# EAGLE design RpiStack (EAGLE 9.3.0)
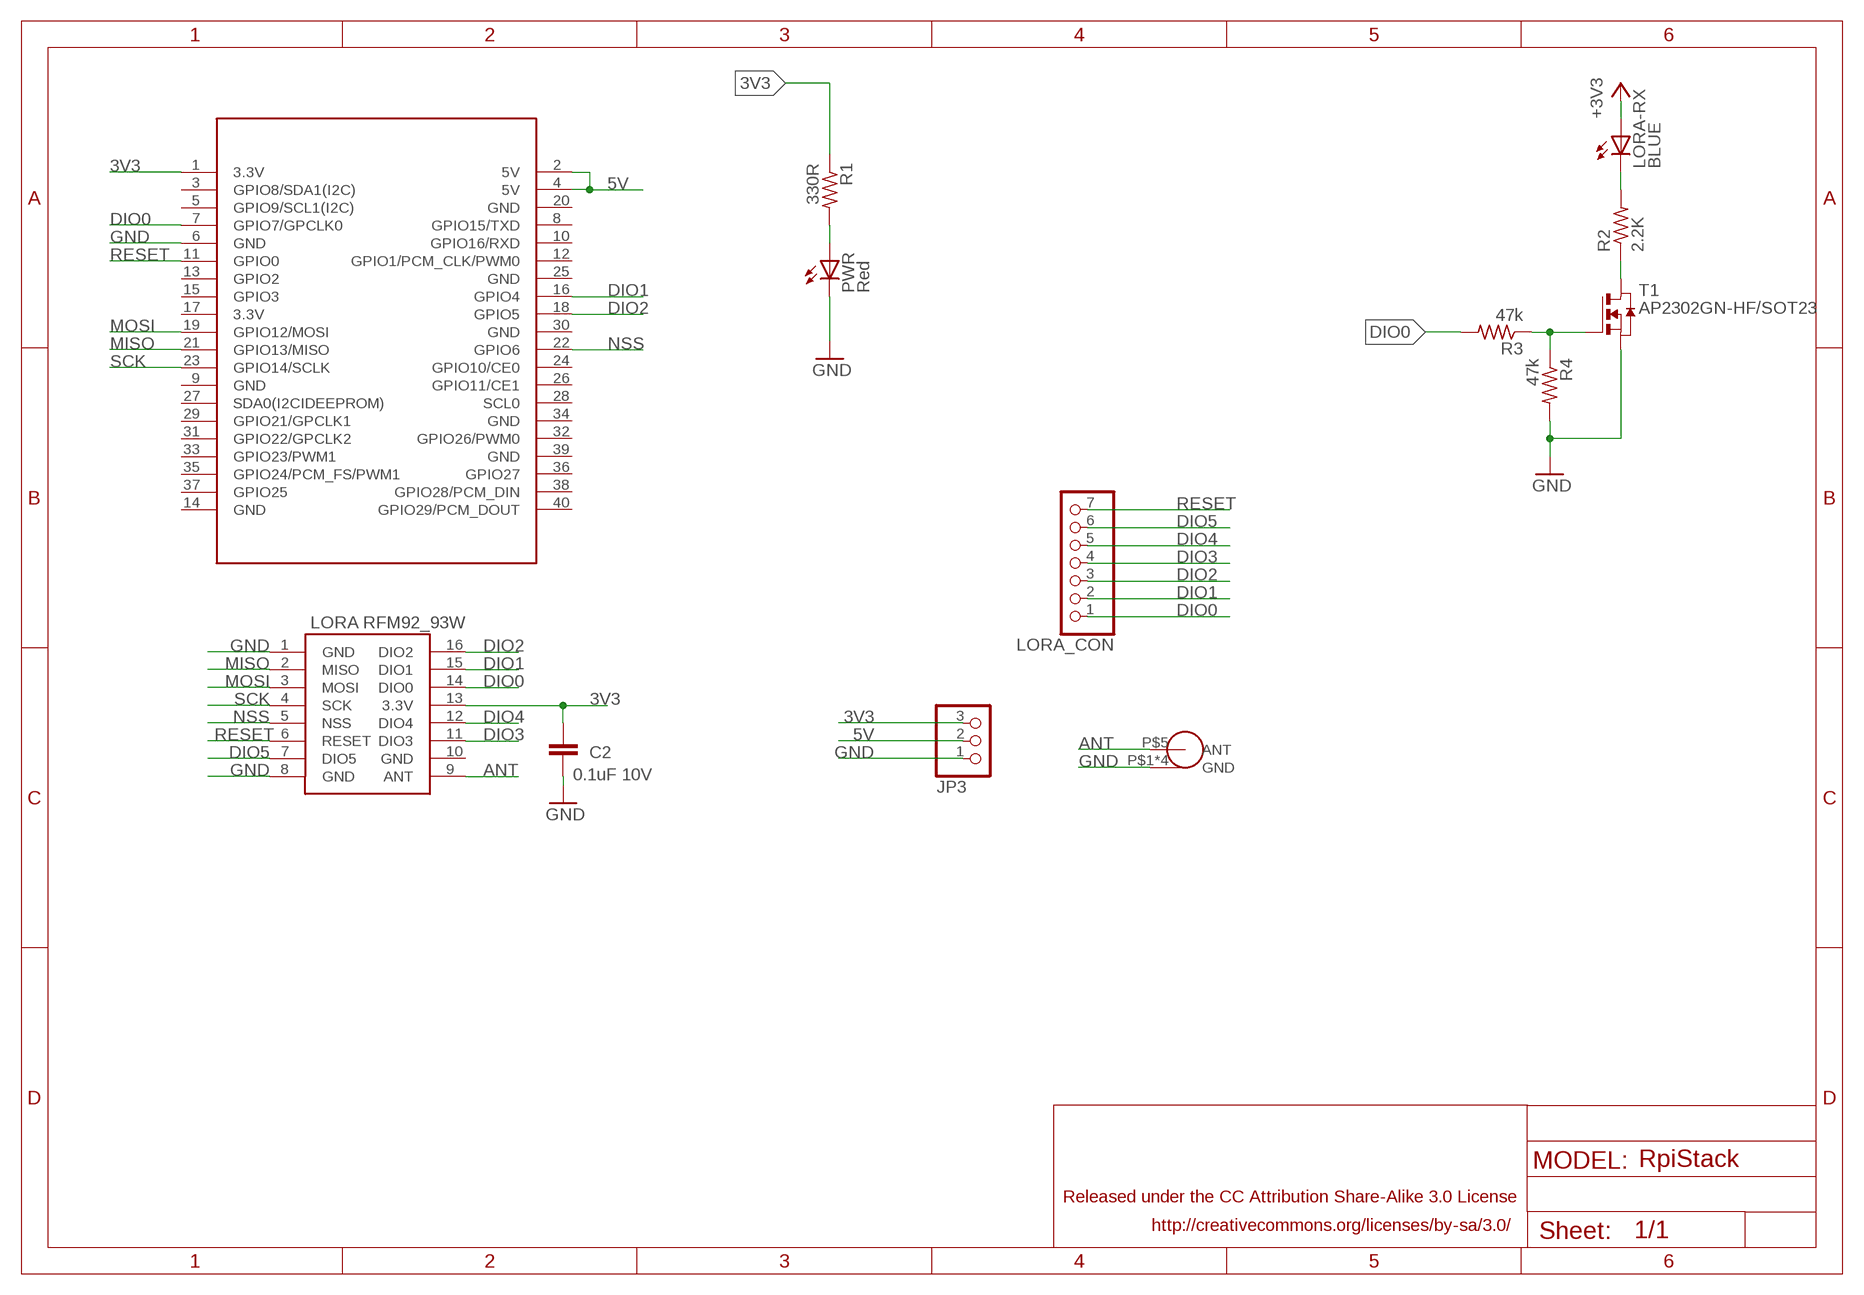
[diagram p0: schematic, sheet 1]

## Parts
C2  0.1uF 10V  C-EUC0402  [C0402]
JP3  PINHD-1X3  [1X03]
LORA  RFM92_93W  [RFM92_93W]
LORA-RX  BLUE  LEDCHIPLED_0603  [CHIPLED_0603]
LORA_ANT  SMA-KE  [SMA-KE]
LORA_CON  PINHD-1X7  [1X07]
PWR  Red  LEDCHIPLED_0603  [CHIPLED_0603]
R1  330R  R-US_R0402  [R0402]
R2  2.2K  R-US_R0402  [R0402]
R3  47k  R-US_R0402  [R0402]
R4  47k  R-US_R0402  [R0402]
T1  AP2302GN-HF/SOT23  NMOSFET-SOT23  [SOT-23]
U$2  RPILORASHIELD  [RPILORASHIELD]

## Nets
3V3: C2.2 JP3.3 LORA-RX.A LORA.13(3.3V) R1.1 U$2.1(3.3V) ; supply symbol labelled +3V3
5V: JP3.2 U$2.2(5V) U$2.4(5V)
/RESET: R2.1 T1.1(D)
ANT: LORA.9(ANT) LORA_ANT.P$5(ANT)
DIO0: LORA.14(DIO0) LORA_CON.1 R3.2 U$2.7(GPIO7/GPCLK0)
DIO1: LORA.15(DIO1) LORA_CON.2 U$2.16(GPIO4)
DIO2: LORA.16(DIO2) LORA_CON.3 U$2.18(GPIO5)
DIO3: LORA.11(DIO3) LORA_CON.4
DIO4: LORA.12(DIO4) LORA_CON.5
DIO5: LORA.7(DIO5) LORA_CON.6
GND: C2.1 JP3.1 LORA.1(GND) LORA.8(GND) LORA_ANT.P$1(GND) LORA_ANT.P$2(GND) LORA_ANT.P$3(GND) LORA_ANT.P$4(GND) PWR.C R4.2 T1.2(S) U$2.6(GND)
MISO: LORA.2(MISO) U$2.21(GPIO13/MISO)
MOSI: LORA.3(MOSI) U$2.19(GPIO12/MOSI)
N$1: R3.1 R4.1 T1.3(G)
N$6: PWR.A R1.2
N$60: LORA-RX.C R2.2
NSS: LORA.5(NSS) U$2.22(GPIO6)
RESET: LORA.6(RESET) LORA_CON.7 U$2.11(GPIO0)
SCK: LORA.4(SCK) U$2.23(GPIO14/SCLK)
Unconnected: U$2.3(GPIO8/SDA1(I2C)) U$2.5(GPIO9/SCL1(I2C)) U$2.8(GPIO15/TXD) U$2.9(GND) U$2.10(GPIO16/RXD) U$2.12(GPIO1/PCM_CLK/PWM0) U$2.13(GPIO2) U$2.14(GND) U$2.15(GPIO3) U$2.17(3.3V) U$2.20(GND) U$2.24(GPIO10/CE0) U$2.25(GND) U$2.26(GPIO11/CE1) U$2.27(SDA0(I2CIDEEPROM)) U$2.28(SCL0) U$2.29(GPIO21/GPCLK1) U$2.30(GND) U$2.31(GPIO22/GPCLK2) U$2.32(GPIO26/PWM0) U$2.33(GPIO23/PWM1) U$2.34(GND) U$2.35(GPIO24/PCM_FS/PWM1) U$2.36(GPIO27) U$2.37(GPIO25) U$2.38(GPIO28/PCM_DIN) U$2.39(GND) U$2.40(GPIO29/PCM_DOUT)

## Power pins joined to a net without a drawn wire
GND: LORA.10(GND)

## Library data of the parts
C2 = dragino-passive:C-EU: CAPACITOR, European symbol
JP3 = pinhead:PINHD-1X3: PIN HEADER
LORA = dragino:RFM92_93W
LORA-RX = dragino-passive:LED: LED OSRAM: - CHIPLED LG R971, LG N971, LY N971, LG Q971, LY Q971, LO R971, LY R971 LH N974, LH R974 LS Q976, LO Q976, LY Q976 LO Q996 - Hyper CHIPLED LW Q18S LB Q993, LB Q99A, LB R99A - SideLED LS A670, LO A670, LY A670, LG A670, LP A670 LB A673, LV A673, LT A673, LW A673 LH A674 LY A675 LS A676, LA A676, LO A676, LY A676, LW A676 LS A679, LY A679, LG A679 - Hyper Micro SIDELED® LS Y876, LA Y876, LO Y876, LY Y876 LT Y87S - SmartLED LW L88C, LW L88S LB L89C, LB L89S, LG L890 LS L89K, LO L89K, LY L89K LS L896, LA L896, LO L896, LY L896 - TOPLED LS T670, LO T670, LY T670, LG T670, LP T670 LSG T670, LSP T670, LSY T670, LOP T670, LYG T670 LG T671, LOG T671, LSG T671 LB T673, LV T673, LT T673, LW T673 LH T674 LS T676, LA T676, LO T676, LY T676, LB T676, LH T676, LSB T676, LW T676 LB T67C, LV T67C, LT T67C, LS T67K, LO T67K, LY T67K, LW E67C LS E67B, LA E67B, LO E67B, LY E67B, LB E67C, LV E67C, LT E67C LW T67C LS T679, LY T679, LG T679 LS T770, LO T770, LY T770, LG T770, LP T770 LB T773, LV T773, LT T773, LW T773 LH T774 LS E675, LA E675, LY E675, LS T675 LS T776, LA T776, LO T776, LY T776, LB T776 LHGB T686 LT T68C, LB T68C - Hyper Mini TOPLED® LB M676 - Mini TOPLED Santana® LG M470 LS M47K, LO M47K, LY M47K Source: http://www.osram.convergy.de LUXEON: - LUMILED® LXK2-PW12-R00, LXK2-PW12-S00, LXK2-PW14-U00, LXK2-PW14-V00 LXK2-PM12-R00, LXK2-PM12-S00, LXK2-PM14-U00 LXK2-PE12-Q00, LXK2-PE12-R00, LXK2-PE12-S00, LXK2-PE14-T00, LXK2-PE14-U00 LXK2-PB12-K00, LXK2-PB12-L00, LXK2-PB12-M00, LXK2-PB14-N00, LXK2-PB14-P00, LXK2-PB14-Q00 LXK2-PR12-L00, LXK2-PR12-M00, LXK2-PR14-Q00, LXK2-PR14-R00 LXK2-PD12-Q00, LXK2-PD12-R00, LXK2-PD12-S00 LXK2-PH12-R00, LXK2-PH12-S00 LXK2-PL12-P00, LXK2-PL12-Q00, LXK2-PL12-R00 Source: www.luxeon.com KINGBRIGHT: KA-3528ASYC Source: www.kingbright.com
LORA_ANT = sma-ke:SMA-KE
LORA_CON = pinhead:PINHD-1X7: PIN HEADER
PWR = dragino:LED: LED OSRAM: - CHIPLED LG R971, LG N971, LY N971, LG Q971, LY Q971, LO R971, LY R971 LH N974, LH R974 LS Q976, LO Q976, LY Q976 LO Q996 - Hyper CHIPLED LW Q18S LB Q993, LB Q99A, LB R99A - SideLED LS A670, LO A670, LY A670, LG A670, LP A670 LB A673, LV A673, LT A673, LW A673 LH A674 LY A675 LS A676, LA A676, LO A676, LY A676, LW A676 LS A679, LY A679, LG A679 - Hyper Micro SIDELED® LS Y876, LA Y876, LO Y876, LY Y876 LT Y87S - SmartLED LW L88C, LW L88S LB L89C, LB L89S, LG L890 LS L89K, LO L89K, LY L89K LS L896, LA L896, LO L896, LY L896 - TOPLED LS T670, LO T670, LY T670, LG T670, LP T670 LSG T670, LSP T670, LSY T670, LOP T670, LYG T670 LG T671, LOG T671, LSG T671 LB T673, LV T673, LT T673, LW T673 LH T674 LS T676, LA T676, LO T676, LY T676, LB T676, LH T676, LSB T676, LW T676 LB T67C, LV T67C, LT T67C, LS T67K, LO T67K, LY T67K, LW E67C LS E67B, LA E67B, LO E67B, LY E67B, LB E67C, LV E67C, LT E67C LW T67C LS T679, LY T679, LG T679 LS T770, LO T770, LY T770, LG T770, LP T770 LB T773, LV T773, LT T773, LW T773 LH T774 LS E675, LA E675, LY E675, LS T675 LS T776, LA T776, LO T776, LY T776, LB T776 LHGB T686 LT T68C, LB T68C - Hyper Mini TOPLED® LB M676 - Mini TOPLED Santana® LG M470 LS M47K, LO M47K, LY M47K Source: http://www.osram.convergy.de LUXEON: - LUMILED® LXK2-PW12-R00, LXK2-PW12-S00, LXK2-PW14-U00, LXK2-PW14-V00 LXK2-PM12-R00, LXK2-PM12-S00, LXK2-PM14-U00 LXK2-PE12-Q00, LXK2-PE12-R00, LXK2-PE12-S00, LXK2-PE14-T00, LXK2-PE14-U00 LXK2-PB12-K00, LXK2-PB12-L00, LXK2-PB12-M00, LXK2-PB14-N00, LXK2-PB14-P00, LXK2-PB14-Q00 LXK2-PR12-L00, LXK2-PR12-M00, LXK2-PR14-Q00, LXK2-PR14-R00 LXK2-PD12-Q00, LXK2-PD12-R00, LXK2-PD12-S00 LXK2-PH12-R00, LXK2-PH12-S00 LXK2-PL12-P00, LXK2-PL12-Q00, LXK2-PL12-R00 Source: www.luxeon.com KINGBRIGHT: KA-3528ASYC Source: www.kingbright.com
R1-R4 = dragino:R-US_: RESISTOR, American symbol
T1 = dragino:NMOSFET-SOT23: MOS FET; OC_FARNELL: unknown; OC_NEWARK: unknown
U$2 = lorarpi:RPILORASHIELD

## Net classes
2 gnd: width 0.254 mm, drill 0.61 mm, clearance 0.254 mm

## Board
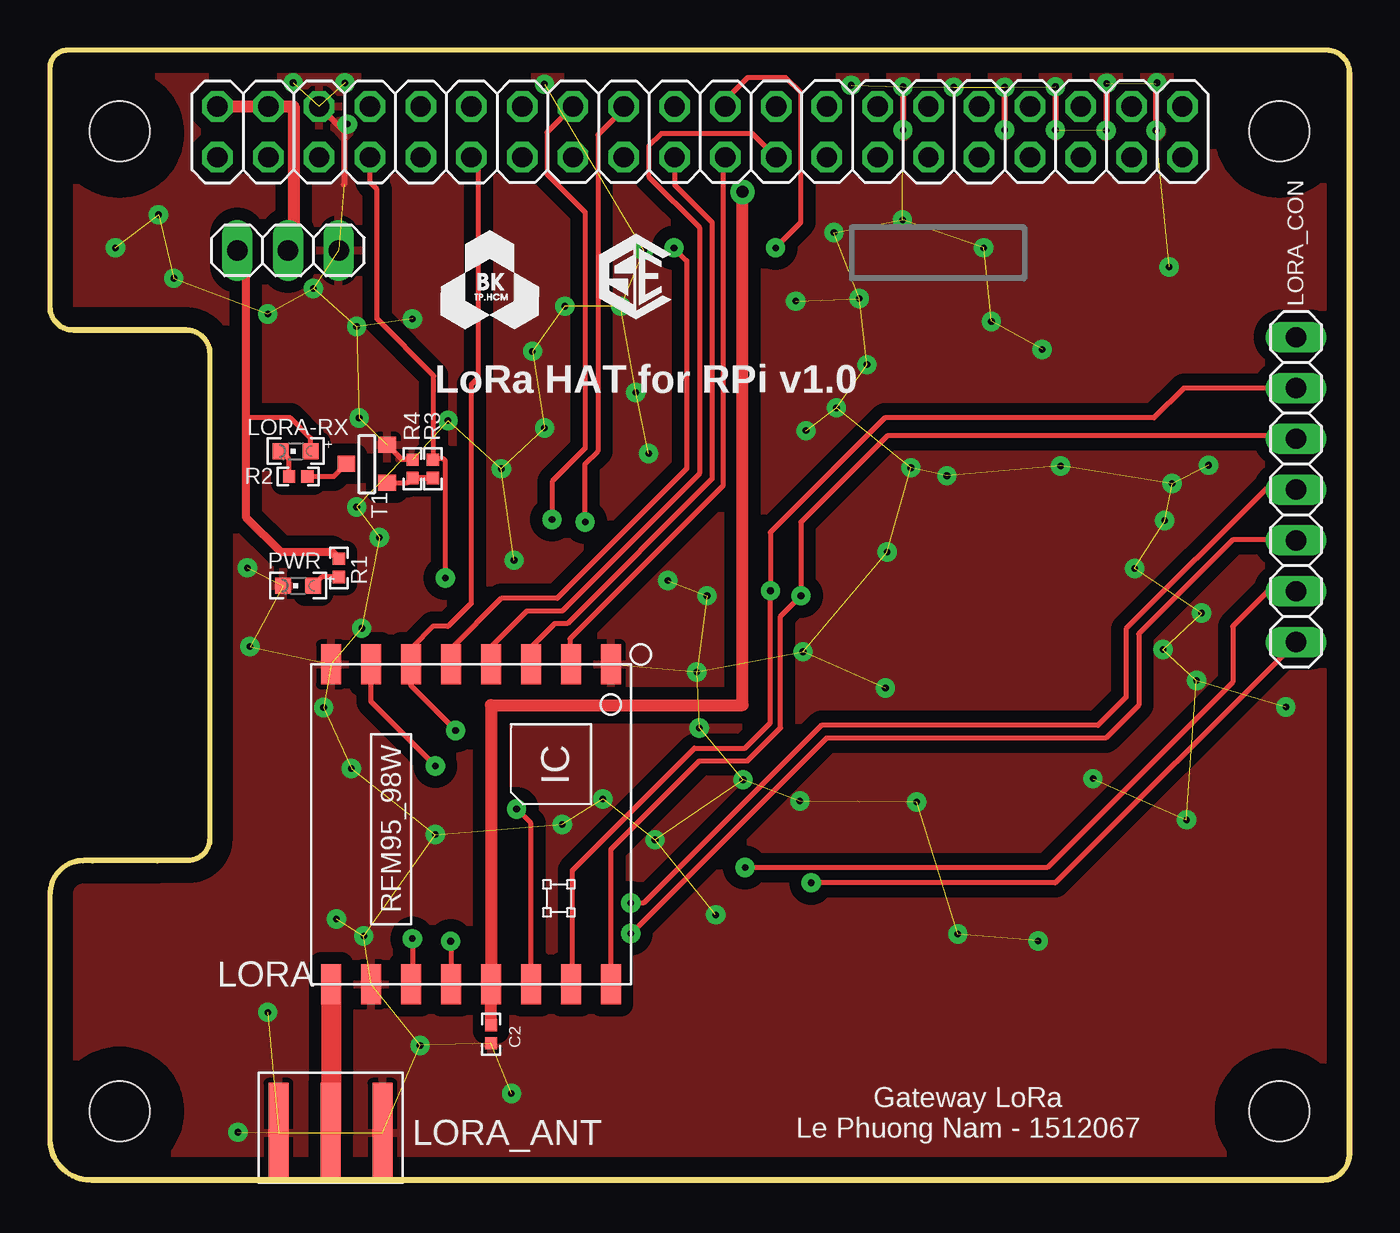
[diagram p1: board, top side]
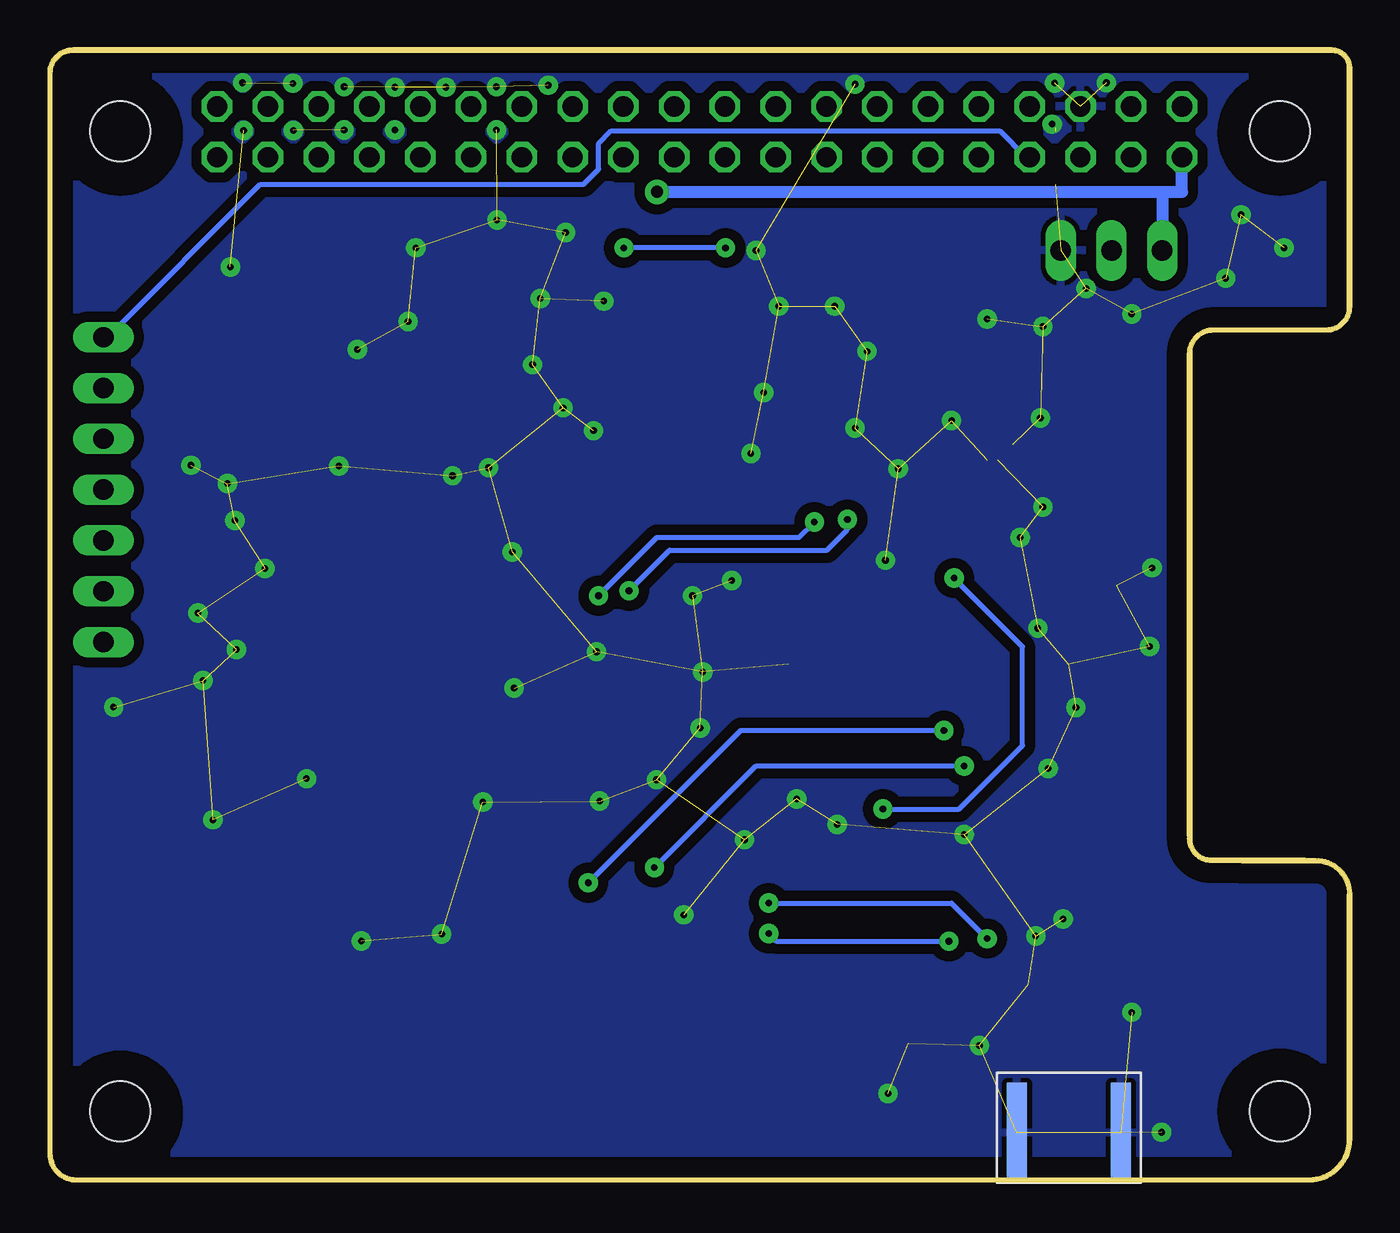
[diagram p2: board, bottom side, seen from below]

Size 65 x 56.51 mm. Coordinates in mm from the lower left corner, seen from the top.
Outline: 5.38,15.97 2.13,15.97
Outline: 2.13,15.97 1.66,15.97 arc90 0,14.31 0,2.03 arc90 2.03,0 63.69,0 arc90 65,1.31 65,55.36 arc90 63.86,56.49 0.88,56.49 arc90 0,55.62 0,43.66 arc90 1.16,42.5 6.81,42.5 arc-90 8,41.32 8,17.08 arc-90 6.9,15.99 2.15,15.99 arc90 2.13,15.97
Copper layers (1*16): Top 0.035mm / dielectric 1.5mm / Bottom 0.035mm
Design rules "default *": minimum track width 10mil, minimum drill 12mil, track to track 6mil, track to pad 6mil, pad to pad 6mil, via to via 6mil, smd to smd 6mil, copper to edge 40mil, drill to drill 8mil, minimum pad ring 10mil, minimum via ring 8mil, stop-mask expansion 4mil, vias tented up to drill 30mil, thermal gap 10mil

### Footprints (pad centres in the part's own frame; a part is rotated, then mirrored left to right if it is on the bottom)
C0402 = smd 0.61 x 0.61: 1 -0.457,0; 2 0.457,0
1X03 = drill 1.016 long: 1 -2.54,0; 2 0,0; 3 2.54,0
RFM92_93W = smd 2 x 1: 1 -8,7; 2 -8,5; 3 -8,3; 4 -8,1; 5 -8,-1; 6 -8,-3; 7 -8,-5; 8 -8,-7; 9 8,-7; 10 8,-5; 11 8,-3; 12 8,-1; 13 8,1; 14 8,3; 15 8,5; 16 8,7
CHIPLED_0603 = smd 0.8 x 0.8: A 0,-0.75; C 0,0.75
SMA-KE = smd 1 x 5: P$1 -2.6,0; P$2 2.6,0; P$5 0,0 | smd 1 x 5 bottom: P$3 -2.6,0; P$4 2.6,0
1X07 = drill 1.016 long: 1 -7.62,0; 2 -5.08,0; 3 -2.54,0; 4 0,0; 5 2.54,0; 6 5.08,0; 7 7.62,0
R0402 = smd 0.61 x 0.61: 1 -0.457,0; 2 0.457,0
SOT-23 = smd 0.787 x 0.889: 1 0,-1.016; 2 -0.95,1.016; 3 0.95,1.016
RPILORASHIELD = drill 1.016 octagon: 1 -24.1,23.2; 2 -24.1,25.74; 3 -21.56,23.2; 4 -21.56,25.74; 5 -19.02,23.2; 6 -19.02,25.74; 7 -16.48,23.2; 8 -16.48,25.74; 9 -13.94,23.2; 10 -13.94,25.74; 11 -11.4,23.2; 12 -11.4,25.74; 13 -8.86,23.2; 14 -8.86,25.74; 15 -6.32,23.2; 16 -6.32,25.74; 17 -3.78,23.2; 18 -3.78,25.74; 19 -1.24,23.2; 20 -1.24,25.74; 21 1.3,23.2; 22 1.3,25.74; 23 3.84,23.2; 24 3.84,25.74; 25 6.38,23.2; 26 6.38,25.74; 27 8.92,23.2; 28 8.92,25.74; 29 11.46,23.2; 30 11.46,25.74; 31 14,23.2; 32 14,25.74; 33 16.54,23.2; 34 16.54,25.74; 35 19.08,23.2; 36 19.08,25.74; 37 21.62,23.2; 38 21.62,25.74; 39 24.16,23.2; 40 24.16,25.74 | hole 3: -29,24.5; -29,-24.5; 29,24.5; 29,-24.5

### Placement (x,y rotation side)
C2  22.07,7.29 90 top
JP3  11.91,46.49 180 top
LORA  21.05,17.79 270 top
LORA-RX  12.29,36.45 90 top
LORA_ANT  14.03,2.36 0 top
LORA_CON  62.33,34.52 270 top
PWR  12.42,29.72 90 top
R1  14.45,30.61 270 top
R2  12.42,35.18 180 top
R3  19.15,35.57 90 top
R4  18.13,35.57 90 top
T1  15.84,35.82 270 top
U$2  32.48,27.95 0 top

### Tracks (layer width: path | path; a pad name or v marks a point on that pad's centre or on a via)
3V3  (via drill 0.6 pad 1.22)
  Top 0.254: LORA-RX.A 13.04,37.1 12.03,38.11 9.93,38.11 9.8,38.23 | C2.2
  Top 0.406: C2.2 22.05,7.75 | JP3.3 9.8,46.06 9.8,38.23 9.8,33.15 11.53,31.42 14.09,31.42 R1.1
  Top 0.61: v34.64,49.41 34.64,23.75 22.05,23.75 LORA.13 22.07,9.77 C2.2
  Bottom 0.61: v34.64,49.41 9.37,49.41 | 9.37,49.41 JP3.3 | 9.37,49.41 8.38,49.41 U$2.1
5V
  Top 0.61: U$2.2 U$2.4 12.19,53.69 12.19,46.49 JP3.2
/RESET
  Top 0.254: R2.1 14.19,35.18 T1.1
ANT
  Top 1: LORA.9 14.05,2.38 LORA_ANT.P$5
DIO0  (via drill 0.33 pad 0.97)
  Top 0.254: LORA.14 24.05,17.83 v23.34,18.55 | U$2.7 16,49.89 16.35,49.54 16.35,43.06 19.2,40.21 19.2,36.07 | v19.78,30.1 19.78,35.95 19.65,36.07 19.2,36.07 | 19.2,36.07 R3.2
  Bottom 0.254: U$2.7 16.18,51.15 17.5,52.46 36.93,52.46 37.56,51.82 37.56,50.55 38.32,49.79 54.48,49.79 62.12,42.14 LORA_CON.1 | v23.34,18.55 19.53,18.55 16.35,21.72 16.35,26.68 v19.78,30.1
DIO1  (via drill 0.33 pad 0.97)
  Top 0.254: U$2.16 24.86,52.39 24.86,50.3 26.77,48.39 26.77,36.58 25.12,34.93 v25.12,33.03 | LORA.15 26.13,9.79 26.13,15.5 32.23,21.6 34.77,21.6 36.04,22.87 v36.04,29.47 36.04,32.39 41.75,38.11 55.21,38.11 56.71,39.6 LORA_CON.2
  Bottom 0.254: v36.04,29.47 34.01,31.5 26.13,31.5 25.12,32.52 v25.12,33.03
DIO2  (via drill 0.33 pad 0.97)
  Top 0.254: LORA.16 28.05,16.53 32.48,20.96 34.89,20.96 36.55,22.61 36.55,28.2 v37.56,29.22 37.56,32.9 41.88,37.22 62.17,37.22 LORA_CON.3 | v26.77,32.9 26.77,35.82 27.4,36.45 27.4,52.26 28.7,53.56 U$2.18
  Bottom 0.254: v37.56,29.22 34.64,32.14 27.53,32.14 v26.77,32.9
DIO3  (via drill 0.33 pad 0.97)
  Top 0.254: LORA_CON.4 60.83,34.52 60.8,34.55 53.82,27.56 53.82,24.14 52.42,22.74 38.58,22.74 29.69,13.85 v29.05,13.85 | v18.13,12.07 18.13,9.71 LORA.11
  Bottom 0.254: v29.05,13.85 19.91,13.85 v18.13,12.07
DIO4  (via drill 0.33 pad 0.97)
  Top 0.254: LORA_CON.5 62.3,32.01 59.15,32.01 54.45,27.31 54.45,23.75 52.8,22.1 38.83,22.1 v29.05,12.32 | v20.04,11.94 20.05,11.93 LORA.12
  Bottom 0.254: v29.05,12.32 28.67,11.94 v20.04,11.94
DIO5  (via drill 0.33 pad 0.97)
  Top 0.254: LORA_CON.6 62.3,29.47 60.93,29.47 59.15,27.69 59.15,24.9 49.88,15.63 v34.77,15.63 | v19.27,20.71 16.05,23.93 LORA.7
  Bottom 0.254: v34.77,15.63 29.69,20.71 v19.27,20.71
GND  (via drill 0.33 pad 0.97)  (94 unrouted)
  Top 0.254: R4.2 17.61,36.02 T1.2
  Top 0.305: v14.88,52.8 14.7,52.62 14.7,50.3 | U$2.6 14.7,52.45 14.7,49.79 | v42.67,54.67 v42.67,52.51 | v47.75,54.64 v47.75,52.51 | v50.29,54.67 v50.29,52.51 | v52.85,54.84 52.85,52.5 v52.83,52.48 | v55.37,54.87 55.32,54.82 v55.32,52.48
  other vias: 3.27,46.61 12.16,54.87 5.43,48.27 6.19,45.09 10.89,43.31 13.18,44.58 15.34,42.68 18.13,43.06 25.75,43.69 28.54,43.69 29.69,46.49 19.91,37.98 24.14,41.44 9.88,30.61 10,26.68 13.69,23.63 18.51,6.74 10.89,8.39 15.08,20.58 23.08,4.32 52.17,20.07 25.62,17.79 27.66,19.06 19.27,17.28 32.35,25.41 32.86,29.22 23.21,30.99 24.73,37.6 29.31,39.38 22.58,35.57 29.94,36.33 41.79,24.6 46.71,46.61 39.21,47.38 42.64,48.01 49.63,41.53 47.09,42.93 40.48,44.07 37.31,43.95 40.86,40.77 37.82,37.47 32.48,22.61 41.87,31.4 50.56,35.71 57.96,35.74 55.76,32.97 54.25,30.59 56.13,34.83 57.6,28.35 55.67,26.52 57.35,24.97 43.36,18.9 49.43,11.96 45.41,12.3 56.85,18.01 61.82,23.65 14.32,13.06 15.69,12.2 9.39,2.39 14.75,54.86 24.73,54.79 45.21,54.64 40.08,54.74 55.98,45.66 33.29,13.26 37.51,18.95 30.91,29.98 15.59,27.59 15.46,38.11 16.48,32.14 15.34,33.66 39.34,38.61 37.66,26.42 34.66,20.02 30.26,17.02 43.06,35.62 44.86,35.22
  pour Bottom (isolate 0.508): 0.1,56.52 0.1,42.42 8.1,42.42 8.1,16.01 0.1,16.01 0.1,0.01 64.99,0.01 64.99,56.52
  pour Top (isolate 0.61): -0.03,56.52 64.99,56.52 64.99,0.01 0.1,0.01 0.1,16.01 8.1,16.01 8.1,42.42 -0.03,42.42
MISO
  Top 0.254: U$2.21 33.65,51.02 33.65,34.71 26,27.06 26,25.83 LORA.2
MOSI
  Top 0.254: U$2.19 31.24,49.76 33.12,47.88 33.12,35.06 25.88,27.82 25.24,27.82 24.1,26.68 24.1,25.83 LORA.3
N$1
  Top 0.254: T1.3 17.89,34.87 R4.1
  Top 0.305: R4.1 R3.1
N$6
  Top 0.254: R1.2 13.6,30.15 PWR.A
N$60
  Top 0.254: R2.2 11.96,36.03 LORA-RX.C
NSS  (via drill 0.33 pad 0.97)
  Top 0.254: LORA.5 20.05,26.56 22.58,29.09 25.37,29.09 31.85,35.57 31.85,45.98 v31.21,46.61 | v36.29,46.61 37.56,47.88 37.56,54.36 36.8,55.12 34.89,55.12 33.78,54.01 U$2.22
  Bottom 0.254: v31.21,46.61 v36.29,46.61
RESET  (via drill 0.33 pad 0.97)
  Top 0.254: LORA_CON.7 50.29,14.86 v38.07,14.86 | v20.29,22.48 18.05,24.72 LORA.6 18.13,25.86 18.13,26.68 19.15,27.69 19.91,27.69 21.08,28.86 21.08,39.79 21.43,40.14 21.43,50.79 U$2.11
  Bottom 0.254: v38.07,14.86 30.45,22.48 v20.29,22.48
SCK
  Top 0.254: U$2.23 35.14,52.33 30.58,52.33 29.94,51.69 29.94,50.17 32.48,47.63 32.48,35.31 25.62,28.45 23.85,28.45 22.07,26.68 22.07,25.8 LORA.4

### Text on the board
tPlace: LoRa HAT for RPi v1.0 | LORA | Gateway LoRa / Le Phuong Nam - 1512067
tDocu: 433MHZ | 3.3V | 5V | GND | DIO0 | DIO1 | DIO2 | DIO3 | DIO4 | DIO5 | RESET